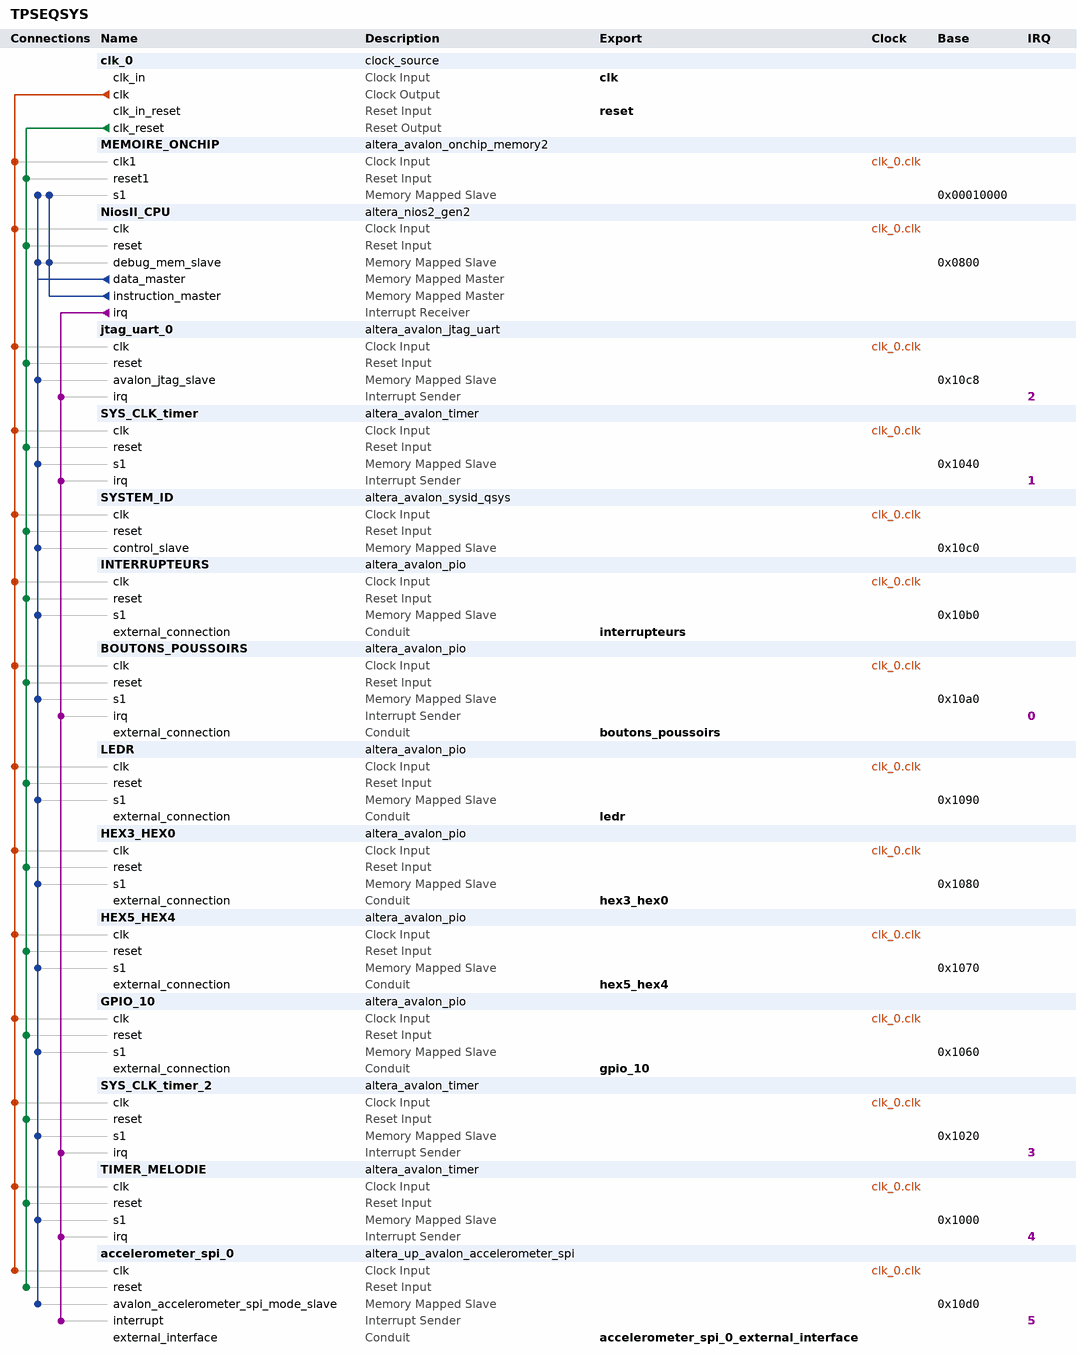
[diagram p0: system contents]
# Platform Designer (Qsys) system TPSEQSYS, MAX 10 10M50DAF484C6GES
# Parameters at their usual value, and those the tool derives, are not listed.
package require -exact qsys 18.1
create_system TPSEQSYS
set_project_property DEVICE_FAMILY {MAX 10}
set_project_property DEVICE 10M50DAF484C6GES

add_instance clk_0 clock_source 18.1
set_instance_parameter_value clk_0 clockFrequency 50000000

add_instance MEMOIRE_ONCHIP altera_avalon_onchip_memory2 18.1
set_instance_parameter_value MEMOIRE_ONCHIP dataWidth 32
set_instance_parameter_value MEMOIRE_ONCHIP dualPort false
set_instance_parameter_value MEMOIRE_ONCHIP initMemContent false
set_instance_parameter_value MEMOIRE_ONCHIP initializationFileName onchip_mem.hex
set_instance_parameter_value MEMOIRE_ONCHIP memorySize 40960

add_instance NiosII_CPU altera_nios2_gen2 18.1
set_instance_parameter_value NiosII_CPU dcache_size 0
set_instance_parameter_value NiosII_CPU exceptionSlave MEMOIRE_ONCHIP.s1
set_instance_parameter_value NiosII_CPU icache_size 2048
set_instance_parameter_value NiosII_CPU impl Fast
set_instance_parameter_value NiosII_CPU resetSlave MEMOIRE_ONCHIP.s1
set_instance_parameter_value NiosII_CPU setting_branchpredictiontype Static

add_instance jtag_uart_0 altera_avalon_jtag_uart 18.1
set_instance_parameter_value jtag_uart_0 simInteractiveOptions NO_INTERACTIVE_WINDOWS

add_instance SYS_CLK_timer altera_avalon_timer 18.1
set_instance_parameter_value SYS_CLK_timer period 1
set_instance_parameter_value SYS_CLK_timer periodUnits MSEC

add_instance SYSTEM_ID altera_avalon_sysid_qsys 18.1
set_instance_parameter_value SYSTEM_ID id -15584170

add_instance INTERRUPTEURS altera_avalon_pio 18.1
set_instance_parameter_value INTERRUPTEURS direction Input
set_instance_parameter_value INTERRUPTEURS width 10

add_instance BOUTONS_POUSSOIRS altera_avalon_pio 18.1
set_instance_parameter_value BOUTONS_POUSSOIRS captureEdge true
set_instance_parameter_value BOUTONS_POUSSOIRS direction Input
set_instance_parameter_value BOUTONS_POUSSOIRS edgeType FALLING
set_instance_parameter_value BOUTONS_POUSSOIRS generateIRQ true
set_instance_parameter_value BOUTONS_POUSSOIRS irqType EDGE
set_instance_parameter_value BOUTONS_POUSSOIRS width 2

add_instance LEDR altera_avalon_pio 18.1
set_instance_parameter_value LEDR direction Output
set_instance_parameter_value LEDR resetValue 597
set_instance_parameter_value LEDR width 10

add_instance HEX3_HEX0 altera_avalon_pio 18.1
set_instance_parameter_value HEX3_HEX0 direction Output
set_instance_parameter_value HEX3_HEX0 resetValue 1077952576
set_instance_parameter_value HEX3_HEX0 width 32

add_instance HEX5_HEX4 altera_avalon_pio 18.1
set_instance_parameter_value HEX5_HEX4 direction Output
set_instance_parameter_value HEX5_HEX4 resetValue 16448
set_instance_parameter_value HEX5_HEX4 width 16

add_instance GPIO_10 altera_avalon_pio 18.1
set_instance_parameter_value GPIO_10 direction Output
set_instance_parameter_value GPIO_10 width 2

add_instance SYS_CLK_timer_2 altera_avalon_timer 18.1
set_instance_parameter_value SYS_CLK_timer_2 period 1
set_instance_parameter_value SYS_CLK_timer_2 periodUnits MSEC

add_instance TIMER_MELODIE altera_avalon_timer 18.1
set_instance_parameter_value TIMER_MELODIE period 1
set_instance_parameter_value TIMER_MELODIE periodUnits MSEC

add_instance accelerometer_spi_0 altera_up_avalon_accelerometer_spi 18.0

# connections
add_connection clk_0.clk accelerometer_spi_0.clk clock
add_connection clk_0.clk BOUTONS_POUSSOIRS.clk clock
add_connection clk_0.clk GPIO_10.clk clock
add_connection clk_0.clk HEX3_HEX0.clk clock
add_connection clk_0.clk HEX5_HEX4.clk clock
add_connection clk_0.clk INTERRUPTEURS.clk clock
add_connection clk_0.clk jtag_uart_0.clk clock
add_connection clk_0.clk LEDR.clk clock
add_connection clk_0.clk MEMOIRE_ONCHIP.clk1 clock
add_connection clk_0.clk NiosII_CPU.clk clock
add_connection clk_0.clk SYS_CLK_timer.clk clock
add_connection clk_0.clk SYS_CLK_timer_2.clk clock
add_connection clk_0.clk SYSTEM_ID.clk clock
add_connection clk_0.clk TIMER_MELODIE.clk clock
add_connection clk_0.clk_reset accelerometer_spi_0.reset reset
add_connection clk_0.clk_reset BOUTONS_POUSSOIRS.reset reset
add_connection clk_0.clk_reset GPIO_10.reset reset
add_connection clk_0.clk_reset HEX3_HEX0.reset reset
add_connection clk_0.clk_reset HEX5_HEX4.reset reset
add_connection clk_0.clk_reset INTERRUPTEURS.reset reset
add_connection clk_0.clk_reset jtag_uart_0.reset reset
add_connection clk_0.clk_reset LEDR.reset reset
add_connection clk_0.clk_reset MEMOIRE_ONCHIP.reset1 reset
add_connection clk_0.clk_reset NiosII_CPU.reset reset
add_connection clk_0.clk_reset SYS_CLK_timer.reset reset
add_connection clk_0.clk_reset SYS_CLK_timer_2.reset reset
add_connection clk_0.clk_reset SYSTEM_ID.reset reset
add_connection clk_0.clk_reset TIMER_MELODIE.reset reset
add_connection NiosII_CPU.data_master accelerometer_spi_0.avalon_accelerometer_spi_mode_slave avalon
set_connection_parameter_value NiosII_CPU.data_master/accelerometer_spi_0.avalon_accelerometer_spi_mode_slave baseAddress 0x10d0
add_connection NiosII_CPU.data_master BOUTONS_POUSSOIRS.s1 avalon
set_connection_parameter_value NiosII_CPU.data_master/BOUTONS_POUSSOIRS.s1 baseAddress 0x10a0
add_connection NiosII_CPU.data_master GPIO_10.s1 avalon
set_connection_parameter_value NiosII_CPU.data_master/GPIO_10.s1 baseAddress 0x1060
add_connection NiosII_CPU.data_master HEX3_HEX0.s1 avalon
set_connection_parameter_value NiosII_CPU.data_master/HEX3_HEX0.s1 baseAddress 0x1080
add_connection NiosII_CPU.data_master HEX5_HEX4.s1 avalon
set_connection_parameter_value NiosII_CPU.data_master/HEX5_HEX4.s1 baseAddress 0x1070
add_connection NiosII_CPU.data_master INTERRUPTEURS.s1 avalon
set_connection_parameter_value NiosII_CPU.data_master/INTERRUPTEURS.s1 baseAddress 0x10b0
add_connection NiosII_CPU.data_master jtag_uart_0.avalon_jtag_slave avalon
set_connection_parameter_value NiosII_CPU.data_master/jtag_uart_0.avalon_jtag_slave baseAddress 0x10c8
add_connection NiosII_CPU.data_master LEDR.s1 avalon
set_connection_parameter_value NiosII_CPU.data_master/LEDR.s1 baseAddress 0x1090
add_connection NiosII_CPU.data_master MEMOIRE_ONCHIP.s1 avalon
set_connection_parameter_value NiosII_CPU.data_master/MEMOIRE_ONCHIP.s1 baseAddress 0x00010000
add_connection NiosII_CPU.data_master NiosII_CPU.debug_mem_slave avalon
set_connection_parameter_value NiosII_CPU.data_master/NiosII_CPU.debug_mem_slave baseAddress 0x0800
add_connection NiosII_CPU.data_master SYS_CLK_timer.s1 avalon
set_connection_parameter_value NiosII_CPU.data_master/SYS_CLK_timer.s1 baseAddress 0x1040
add_connection NiosII_CPU.data_master SYS_CLK_timer_2.s1 avalon
set_connection_parameter_value NiosII_CPU.data_master/SYS_CLK_timer_2.s1 baseAddress 0x1020
add_connection NiosII_CPU.data_master SYSTEM_ID.control_slave avalon
set_connection_parameter_value NiosII_CPU.data_master/SYSTEM_ID.control_slave baseAddress 0x10c0
add_connection NiosII_CPU.data_master TIMER_MELODIE.s1 avalon
set_connection_parameter_value NiosII_CPU.data_master/TIMER_MELODIE.s1 baseAddress 0x1000
add_connection NiosII_CPU.instruction_master MEMOIRE_ONCHIP.s1 avalon
set_connection_parameter_value NiosII_CPU.instruction_master/MEMOIRE_ONCHIP.s1 baseAddress 0x00010000
add_connection NiosII_CPU.instruction_master NiosII_CPU.debug_mem_slave avalon
set_connection_parameter_value NiosII_CPU.instruction_master/NiosII_CPU.debug_mem_slave baseAddress 0x0800
add_connection NiosII_CPU.irq accelerometer_spi_0.interrupt interrupt
set_connection_parameter_value NiosII_CPU.irq/accelerometer_spi_0.interrupt irqNumber 5
add_connection NiosII_CPU.irq BOUTONS_POUSSOIRS.irq interrupt
set_connection_parameter_value NiosII_CPU.irq/BOUTONS_POUSSOIRS.irq irqNumber 0
add_connection NiosII_CPU.irq jtag_uart_0.irq interrupt
set_connection_parameter_value NiosII_CPU.irq/jtag_uart_0.irq irqNumber 2
add_connection NiosII_CPU.irq SYS_CLK_timer.irq interrupt
set_connection_parameter_value NiosII_CPU.irq/SYS_CLK_timer.irq irqNumber 1
add_connection NiosII_CPU.irq SYS_CLK_timer_2.irq interrupt
set_connection_parameter_value NiosII_CPU.irq/SYS_CLK_timer_2.irq irqNumber 3
add_connection NiosII_CPU.irq TIMER_MELODIE.irq interrupt
set_connection_parameter_value NiosII_CPU.irq/TIMER_MELODIE.irq irqNumber 4

# exported interfaces
add_interface accelerometer_spi_0_external_interface conduit end
set_interface_property accelerometer_spi_0_external_interface EXPORT_OF accelerometer_spi_0.external_interface
add_interface boutons_poussoirs conduit end
set_interface_property boutons_poussoirs EXPORT_OF BOUTONS_POUSSOIRS.external_connection
add_interface clk clock sink
set_interface_property clk EXPORT_OF clk_0.clk_in
add_interface gpio_10 conduit end
set_interface_property gpio_10 EXPORT_OF GPIO_10.external_connection
add_interface hex3_hex0 conduit end
set_interface_property hex3_hex0 EXPORT_OF HEX3_HEX0.external_connection
add_interface hex5_hex4 conduit end
set_interface_property hex5_hex4 EXPORT_OF HEX5_HEX4.external_connection
add_interface interrupteurs conduit end
set_interface_property interrupteurs EXPORT_OF INTERRUPTEURS.external_connection
add_interface ledr conduit end
set_interface_property ledr EXPORT_OF LEDR.external_connection
add_interface reset reset sink
set_interface_property reset EXPORT_OF clk_0.clk_in_reset

set_interconnect_requirement {$system} qsys_mm.clockCrossingAdapter HANDSHAKE
set_interconnect_requirement {$system} qsys_mm.enableEccProtection FALSE
set_interconnect_requirement {$system} qsys_mm.insertDefaultSlave FALSE
set_interconnect_requirement {$system} qsys_mm.maxAdditionalLatency 1

save_system TPSEQSYS.qsys
